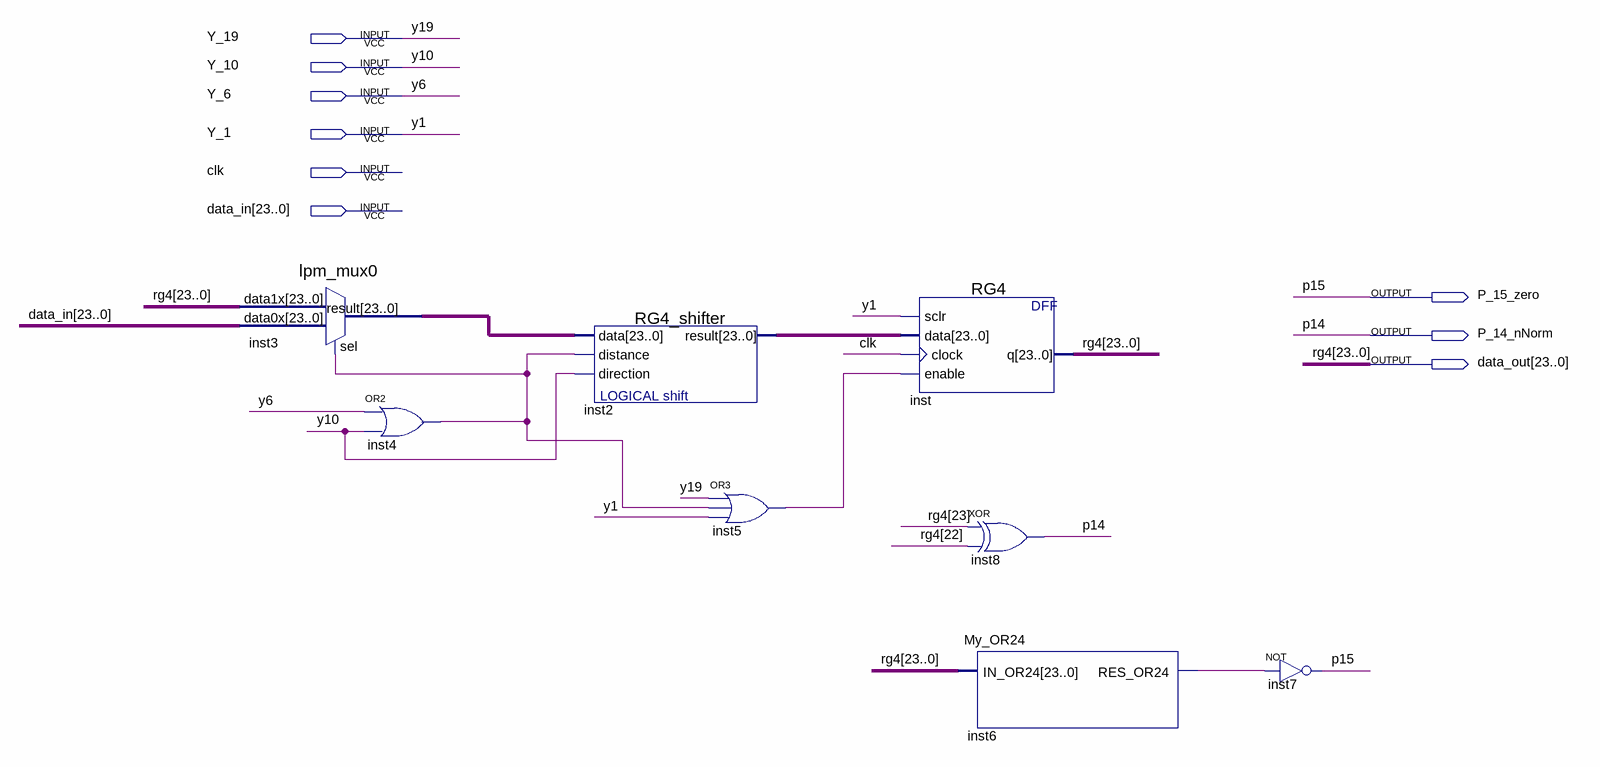
[diagram p0: schematic sheet]
// Quartus schematic RG4_alu.bdf as structural Verilog: 8 symbols, 9 pins
module RG4_alu (
  input  Y_19,
  input  Y_10,
  input  Y_6,
  input  Y_1,
  input  clk,
  input  [23:0] data_in,
  output P_15_zero,
  output P_14_nNorm,
  output [23:0] data_out
);

  wire inst4_out, inst5_out, inst6_res_or24;
  wire [23:0] inst2_result, inst3_result;

  lpm_mux0 inst3 (.data1x(data_out), .data0x(data_in), .sel(inst4_out), .result(inst3_result));
  or inst4 (inst4_out, Y_6, Y_10);
  RG4_shifter inst2 (.data(inst3_result), .distance(inst4_out), .direction(Y_10), .result(inst2_result));
  or inst5 (inst5_out, Y_19, inst4_out, Y_1);
  RG4 inst (.sclr(Y_1), .data(inst2_result), .clock(clk), .enable(inst5_out), .q(data_out));
  xor inst8 (P_14_nNorm, data_out[23], data_out[22]);
  My_OR24 inst6 (.IN_OR24(data_out), .RES_OR24(inst6_res_or24));
  not inst7 (P_15_zero, inst6_res_or24);

  // Other names for the same wires on the sheet: p14 = P_14_nNorm; p15 = P_15_zero; rg4[23:0] = data_out; y1 = Y_1;
  //   y6 = Y_6; y10 = Y_10; y19 = Y_19
endmodule
